# EAGLE design V5.1 - WT32-SC01 (EAGLE 9.6.2)
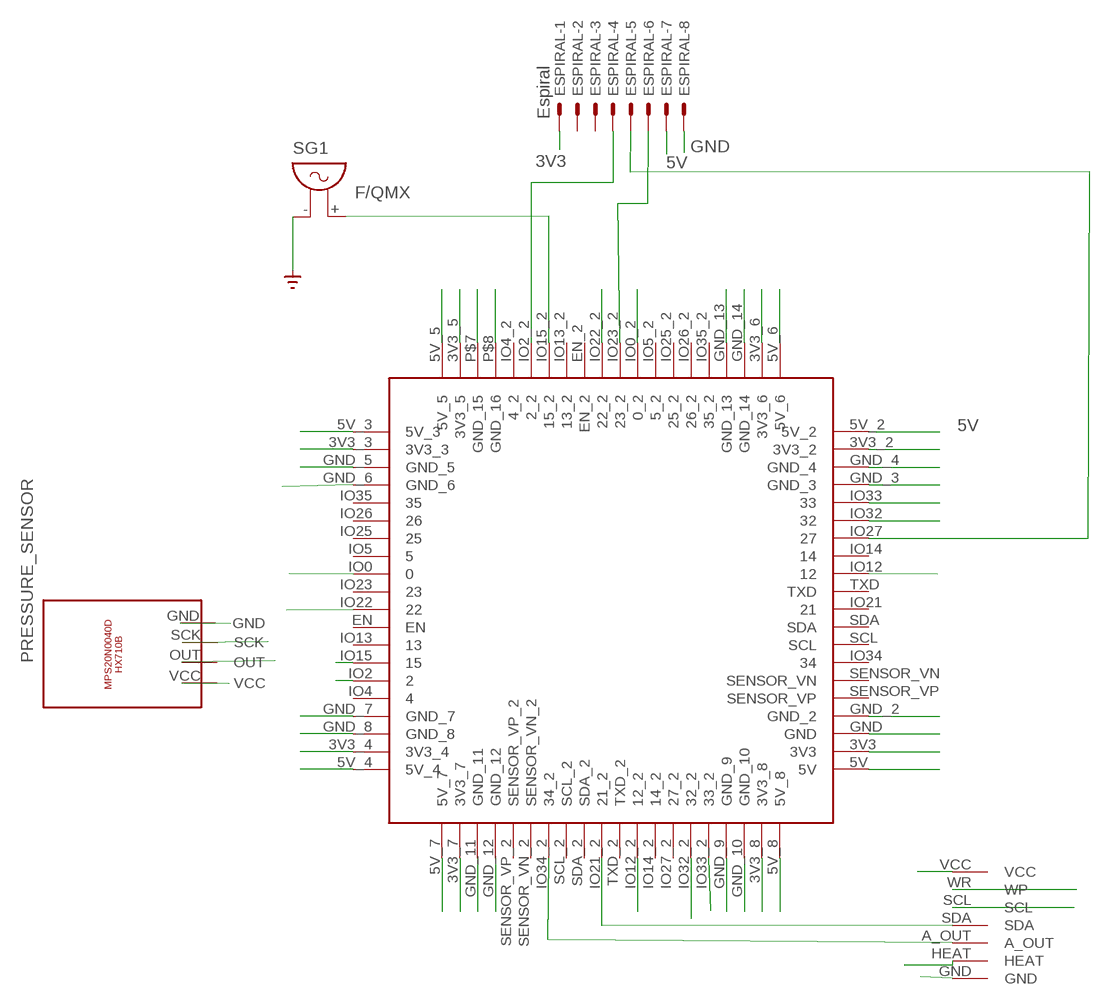
[diagram p0: schematic, sheet 1]

## Parts
ESPIRAL  Espiral  22-05-7088-08  [7395-08]
PRESSURE_SENSOR  PRESSURE_SENSORWITH_SMDPADS&THROUGHHOLES  [MPS20N0040D]
SG1  F/QMX  [F/QMX]
U$1  SENSOR  [SENSOR]
U$2  WT32_SC01  [WT32]

## Nets
3V3: ESPIRAL.1 U$2.3V3 U$2.3V3_2 U$2.3V3_3 U$2.3V3_4 U$2.3V3_5 U$2.3V3_6
5V: ESPIRAL.7 PRESSURE_SENSOR.VCC U$1.VCC U$2.5V U$2.5V_2 U$2.5V_3 U$2.5V_4 U$2.5V_5 U$2.5V_6 U$2.5V_7 U$2.5V_8
GND: ESPIRAL.8 PRESSURE_SENSOR.GND SG1.- U$1.GND U$2.GND U$2.GND_2 U$2.GND_3 U$2.GND_4 U$2.GND_5 U$2.GND_6 U$2.GND_7 U$2.GND_8 U$2.GND_9 U$2.GND_10 U$2.GND_11 U$2.GND_12 U$2.GND_13 U$2.GND_14 U$2.P$7(GND_15) U$2.P$8(GND_16) ; supply symbol labelled SUPPLY_BRASTAN_GND_
IO0: U$1.HEAT U$2.IO0 U$2.IO0_2(0_2)
IO2: ESPIRAL.4 U$2.IO2 U$2.IO2_2(2_2)
IO12: U$1.WR(WP) U$2.IO12 U$2.IO12_2(12_2)
IO15: SG1.+ U$2.IO15 U$2.IO15_2(15_2)
IO22: U$1.SCL U$2.IO22 U$2.IO22_2(22_2)
IO32: PRESSURE_SENSOR.OUT U$2.IO32 U$2.IO32_2(32_2)
IO33: PRESSURE_SENSOR.SCK U$2.IO33 U$2.IO33_2(33_2)
N$1: ESPIRAL.6 U$2.IO23_2(23_2)
N$5: U$2.3V3_8
N$6: U$2.3V3_7
N$8: U$1.A_OUT U$2.IO34_2(34_2)
N$14: U$1.SDA U$2.IO21_2(21_2)
N$23: ESPIRAL.5 U$2.IO27
Unconnected: ESPIRAL.2 ESPIRAL.3 U$2.EN U$2.EN_2 U$2.IO4 U$2.IO4_2(4_2) U$2.IO5 U$2.IO5_2(5_2) U$2.IO13 U$2.IO13_2(13_2) U$2.IO14 U$2.IO14_2(14_2) U$2.IO21 U$2.IO23 U$2.IO25 U$2.IO25_2(25_2) U$2.IO26 U$2.IO26_2(26_2) U$2.IO27_2(27_2) U$2.IO34 U$2.IO35 U$2.IO35_2(35_2) U$2.SCL U$2.SCL_2 U$2.SDA U$2.SDA_2 U$2.SENSOR_VN U$2.SENSOR_VN_2 U$2.SENSOR_VP U$2.SENSOR_VP_2 U$2.TXD U$2.TXD_2

## Library data of the parts
ESPIRAL = con-molex:22-?-08: CONNECTOR wire to board 2.54 mm (.1 inch) pitch header; MF: MOLEX; OC_FARNELL: unknown; OC_NEWARK: unknown
PRESSURE_SENSOR = MPS20N0040D-S - PRESSURE SENSOR:PRESSURE_SENSOR
SG1 = buzzer:F/QMX: BUZZER Source: Buerklin; OC_FARNELL: unknown; OC_NEWARK: unknown
U$1 = Sensor+eeprom:SENSOR
U$2 = WT32_SC01:WT32_SC01

## Net classes
1 New Class: width 0.5 mm, clearance 0.205 mm to class 0, clearance 0.205 mm

## Board
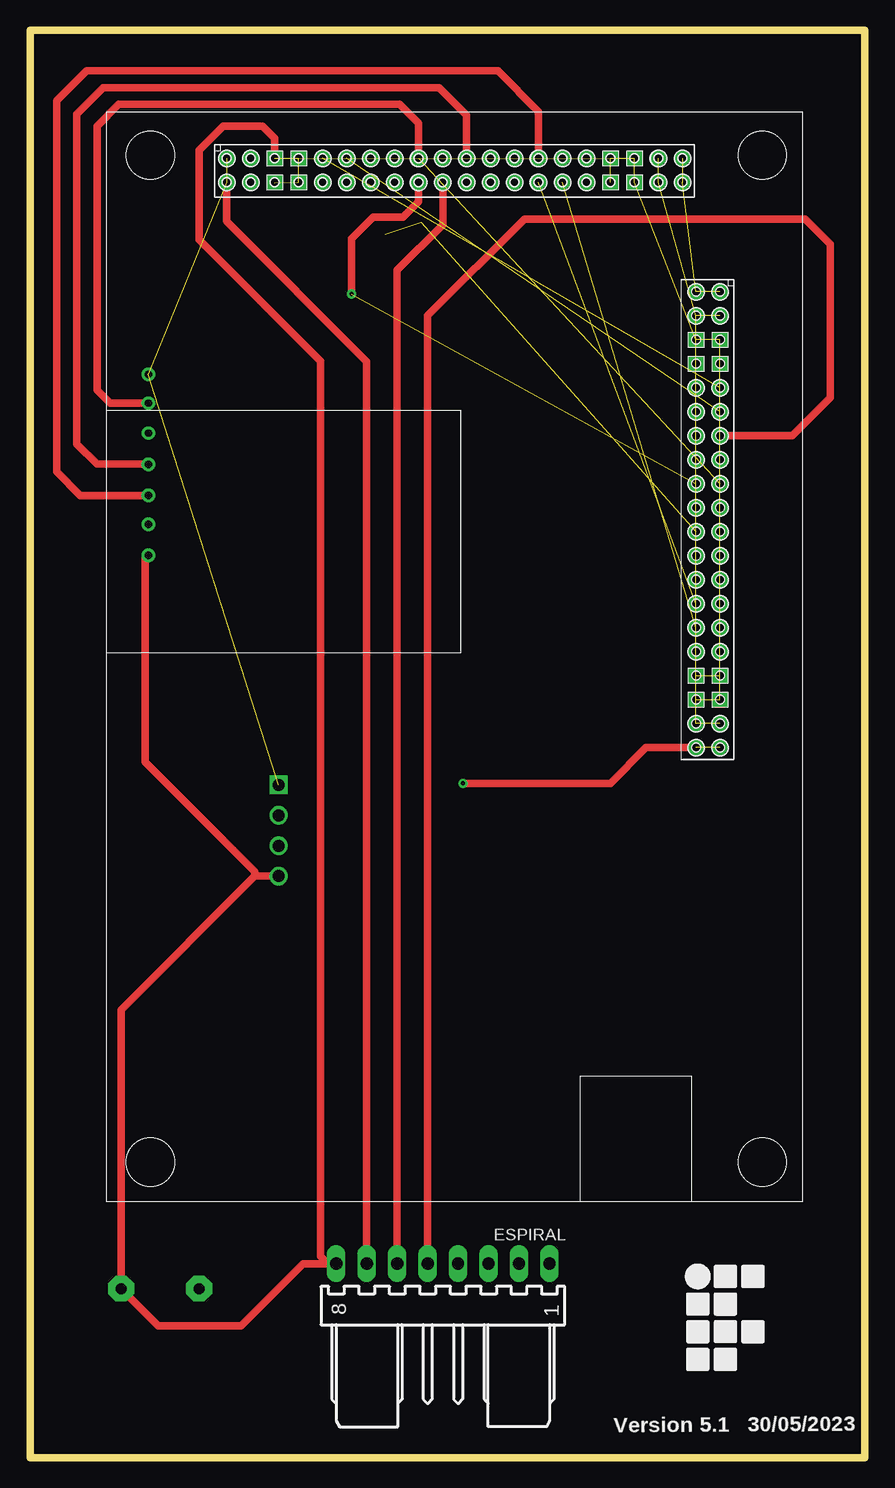
[diagram p1: board, top side]
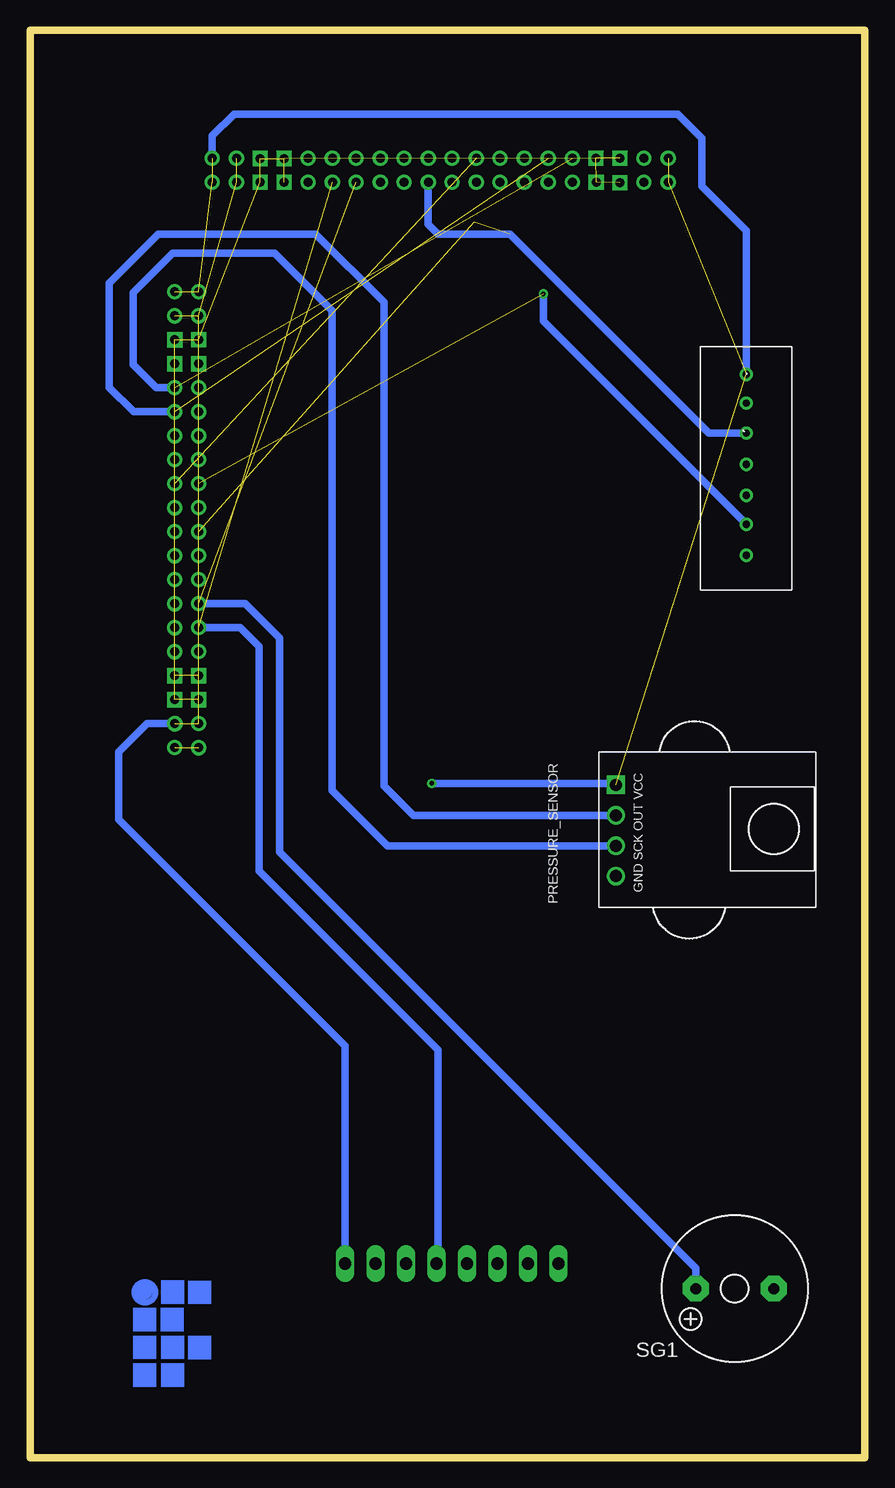
[diagram p2: board, bottom side, seen from below]

Size 69.6 x 119 mm. Coordinates in mm from the lower left corner, seen from the top.
Outline: 0,119 0,0 69.6,0 69.6,119 0,119
Copper layers (1*16): Top 0.035mm / dielectric 1.5mm / Bottom 0.035mm
Design rules "default": minimum track width 6mil, minimum drill 0.35mm, track to track 6mil, track to pad 6mil, pad to pad 6mil, via to via 6mil, smd to smd 6mil, copper to edge 40mil, drill to drill 6mil, minimum pad ring 10mil, minimum via ring 8mil, stop-mask expansion 4mil, vias tented up to drill 0mil, thermal gap 10mil

### Footprints (pad centres in the part's own frame; a part is rotated, then mirrored left to right if it is on the bottom)
7395-08 = drill 1.016 long: 1 8.89,0; 2 6.35,0; 3 3.81,0; 4 1.27,0; 5 -1.27,0; 6 -3.81,0; 7 -6.35,0; 8 -8.89,0
MPS20N0040D = drill 1: GND 3.81,-1.338; OUT -1.27,-1.338; SCK 1.27,-1.338 | drill 1 square: VCC -3.81,-1.338
F/QMX = drill 0.914 pad 2.159 octagon: + 3.251,0; - -3.251,0
SENSOR = drill 0.6: A_OUT 14,7.9; GND 14,2.9; HEAT 14,5.5; SCL 14,13.1; SDA 14,10.5; VCC 14,18; WR 14,15.6
WT32 = drill 0.75: 3V3 -22.56,-18.56; 3V3_2 -22.57,-20.55; 3V3_3 11.43,-18.56; 3V3_4 11.43,-20.57; 3V3_5 22.56,-15.42; 3V3_6 24.57,-15.42; 3V3_7 22.56,18.57; 3V3_8 24.57,18.57; 5V -24.57,-18.57; 5V_2 -24.56,-20.56; 5V_3 13.44,-18.56; 5V_4 13.44,-20.57; 5V_5 22.56,-17.43; 5V_6 24.57,-17.43; 5V_7 22.56,20.58; 5V_8 24.57,20.58; EN -8.56,-18.56; EN_2 22.57,-1.43; IO0 -2.56,-18.56; IO0_2 22.56,4.58; IO2 -14.56,-18.57; IO2_2 22.56,-7.42; IO4 -16.56,-18.57; IO4_2 22.56,-9.43; IO5 -0.56,-18.56; IO5_2 22.56,6.57; IO12 -2.56,-20.56; IO12_2 24.57,4.58; IO13 -10.56,-18.57; IO13_2 22.57,-3.42; IO14 -0.56,-20.57; IO14_2 24.57,6.57; IO15 -12.56,-18.57; IO15_2 22.57,-5.43; IO21 -6.56,-20.56; IO21_2 24.58,0.58; IO22 -6.57,-18.57; IO22_2 22.57,0.58; IO23 -4.56,-18.57; IO23_2 22.56,2.57; IO25 1.43,-18.56; IO25_2 22.56,8.58; IO26 3.43,-18.56; IO26_2 22.56,10.58; IO27 1.43,-20.57; IO27_2 24.57,8.58; IO32 3.43,-20.57; IO32_2 24.57,10.58; IO33 5.44,-20.57; IO33_2 24.57,12.59; IO34 -12.57,-20.57; IO34_2 24.58,-5.43; IO35 5.44,-18.56; IO35_2 22.56,12.59; SCL -10.55,-20.57; SCL_2 24.58,-3.42; SDA -8.57,-20.57; SDA_2 24.58,-1.43; SENSOR_VN -14.57,-20.57; SENSOR_VN_2 24.57,-7.42; SENSOR_VP -16.57,-20.57; SENSOR_VP_2 24.57,-9.43; TXD -4.57,-20.57; TXD_2 24.57,2.57 | drill 0.75 square: GND -20.57,-18.56; GND_2 -18.57,-18.56; GND_3 -20.57,-20.56; GND_4 -18.57,-20.56; GND_5 7.43,-18.56; GND_6 9.44,-18.57; GND_7 22.56,-13.43; GND_8 22.56,-11.43; GND_9 24.55,-13.43; GND_10 24.55,-11.43; GND_11 22.57,14.58; GND_12 22.54,16.57; GND_13 24.56,14.57; GND_14 24.56,16.56; P$7 7.43,-20.56; P$8 9.43,-20.55

### Placement (x,y rotation side)
ESPIRAL  34.43,16.16 0 top
PRESSURE_SENSOR  19.4,52.27 270 bottom
SG1  10.84,14.08 180 bottom
U$1  23.87,72.3 0 bottom
U$2  36.97,83.74 90 top

### Tracks (layer width: path | path; a pad name or v marks a point on that pad's centre or on a via)
3V3  (5 unrouted)
  Bottom 0.61: ESPIRAL.1 43.32,34.32 48.5,39.5 48.7,39.7 62.2,53.2 62.2,58.8 59.83,61.17 U$2.3V3_2
5V  (via drill 0.35)  (7 unrouted)
  Top 0.61: ESPIRAL.7 28.08,91.36 16.39,103.05 U$2.5V_7 | v36.1,56.2 48.4,56.2 51.37,59.17 U$2.5V
  Bottom 0.61: U$1.VCC 9.87,102.27 13.6,106 13.6,110 15.6,112 52.6,112 54.4,110.2 U$2.5V_6 | PRESSURE_SENSOR.VCC 20.84,56.18 36.08,56.18 v36.1,56.2
GND  (15 unrouted)
  Top 0.61: U$2.GND_14 20.41,109.99 19.4,111 16.11,111 14.11,109 14.11,101.52 24.24,91.39 24.24,16.76 24.84,16.16 ESPIRAL.8 22.76,16.16 17.6,11 10.67,11 SG1.- 7.59,37.31 18.74,48.46 | 18.74,48.46 PRESSURE_SENSOR.GND | 18.74,48.46 18.74,48.86 9.6,58 9.6,74.93 U$1.GND
IO0  (via drill 0.35)  (1 unrouted)
  Top 0.61: v26.8,97 26.8,101.6 28.6,103.4 31.1,103.4 32.39,104.69 U$2.IO0_2
  Bottom 0.61: U$1.HEAT 26.8,94.73 v26.8,97
IO2  (1 unrouted)
  Bottom 0.61: ESPIRAL.4 35.6,16.26 35.6,34 50.5,48.9 50.5,67.6 52.08,69.18 U$2.IO2
IO12  (1 unrouted)
  Top 0.61: U$1.WR 6.7,87.9 5.6,89 5.6,111 7.4,112.8 30.8,112.8 32.39,111.21 U$2.IO12_2
IO15  (1 unrouted)
  Bottom 0.61: SG1.+ 14.09,15.79 48.8,50.5 48.8,68.3 51.68,71.18 U$2.IO15
IO22  (2 unrouted)
  Bottom 0.61: U$1.SCL 13,85.4 29.6,102 35.6,102 36.4,102.8 U$2.IO22_2
IO32  (1 unrouted)
  Bottom 0.61: PRESSURE_SENSOR.OUT 37.64,53.54 40.1,56 40.1,96.3 45.8,102 58.9,102 63,97.9 63,89.2 60.97,87.17 U$2.IO32
IO33  (1 unrouted)
  Bottom 0.61: PRESSURE_SENSOR.SCK 39.8,51 44.4,55.6 44.4,95.6 49.2,100.4 57.7,100.4 61,97.1 61,91.1 59.08,89.18 U$2.IO33
N$1
  Top 0.61: ESPIRAL.6 30.62,98.98 34.43,102.79 34.43,106.27 U$2.IO23_2
N$8
  Top 0.61: U$1.A_OUT 4.2,80.2 2.23,82.17 2.23,113.1 4.73,115.6 39,115.6 42.4,112.2 U$2.IO34_2
N$14
  Top 0.61: U$1.SDA 5.6,82.8 3.9,84.5 3.9,112 6.1,114.2 34.1,114.2 36.39,111.91 U$2.IO21_2
N$23
  Top 0.61: ESPIRAL.5 33.16,95.17 41.21,103.22 64.66,103.22 66.74,101.14 66.74,88.35 63.56,85.17 U$2.IO27
(copper drawn outside any net)
  shapes: Bottom area x9, Bottom circle x3

### Text on the board
tNames: Version 5.1 30/05/2023